# Altium schematic sheet HVin.SchDoc
size A; SheetNumber: 5; SheetTotal: 5
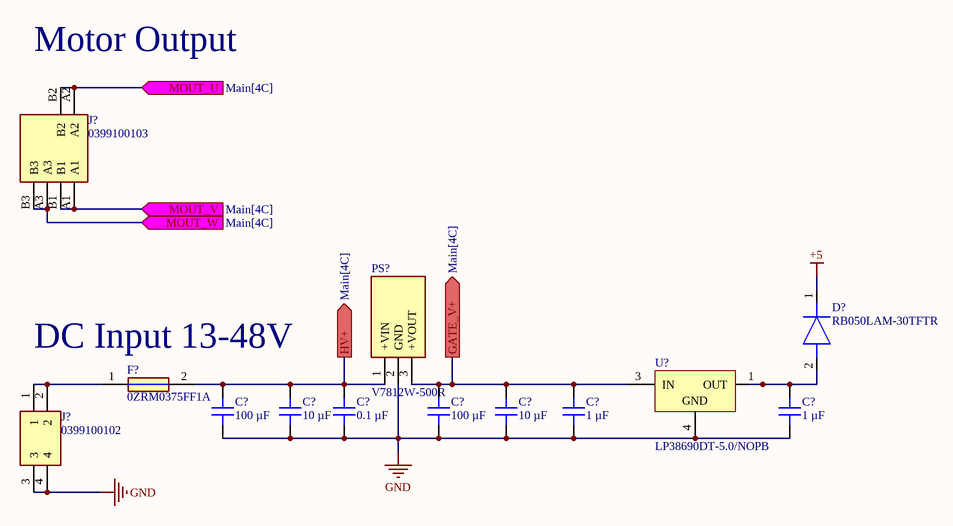
[diagram p0: HVin.SchDoc]

## Parts
(Parts that share a designator on the sheet are numbered #1, #2 ... from top to bottom, then left to right.)
C?#1  100 µF  [CAP 1206_3216 - 0.8MM]
C?#2  10 µF  [CAP 1206_3216 - 0.8MM]
C?#3  0.1 µF  [CAP 1206_3216 - 0.8MM]
C?#4  100 µF  [CAP 1206_3216 - 0.8MM]
C?#5  10 µF  [CAP 1206_3216 - 0.8MM]
C?#6  1 µF  [CAP 1206_3216 - 0.8MM]
C?#7  1 µF  [CAP 1206_3216 - 0.8MM]
D?  RB050LAM-30TFTR  [SODFL4725X95N]
F?  0ZRM0375FF1A  [0ZRM0375FF1A]
J?#1  0399100103  [0399100103]
J?#2  0399100102  [0399100102]
PS?  V7812W-500R  [V78121000R]
U?  LP38690DT-5.0/NOPB  [NDP0003B_M]

## Ports
GATE_V+ (out, see Main[4C]), HV+ (out, see Main[4C]), MOUT_U (in, see Main[4C]), MOUT_V (in, see Main[4C]), MOUT_W (in, see Main[4C])

## Nets
+5: D?.1(K)
GND: C?#1.1 C?#2.1 C?#3.1 C?#4.1 C?#5.1 C?#6.1 C?#7.1 J?#2.3 J?#2.4 PS?.2(GND) U?.4(GND)
GATE_V+: C?#4.2 C?#5.2 C?#6.2 PS?.3(+VOUT) U?.3(IN) ; port GATE_V+
HV+: C?#1.2 C?#2.2 C?#3.2 F?.2 PS?.1(+VIN) ; port HV+
MOUT_U: J?#1.A2 J?#1.B2 ; port MOUT_U
MOUT_V: J?#1.A1 J?#1.B1 ; port MOUT_V
MOUT_W: J?#1.A3 J?#1.B3 ; port MOUT_W
NetC?#7_2: C?#7.2 D?.2(A) U?.1(OUT)
NetF?_1: F?.1 J?#2.1 J?#2.2

## Notes on the sheet
- Motor Output
- DC Input 13-48V

## Library data of the parts
C?#1 C?#4 = C3216X5R0J107M160AB: CAP CER 100UF 6.3V X5R 1206; manufacturer: TDK Corporation; Tolerance: ±20%; Part Number: C3216X5R0J107M160AB; Value: 100 µF; Applications: General Purpose; Capacitance: 100 µF; componentlink1description: Datasheet; componentlink1url: https://product.tdk.com/info/en/catalog/datasheets/mlcc_commercial_general_en.pdf?ref_disty=digikey; componentlink2description: DigiKey Link; componentlink2url: https://www.digikey.com/en/products/detail/tdk-corporation/C3216X5R0J107M160AB/2443486; Device Package: 1206 (3216 Metric); Features: Low ESL; lastupdated: 2/6/2023 8:14:29 PM; Lifecycle Status: Active; Minimum Order: 1; Mounting Type: Surface Mount, MLCC; Operating Temperature: -55°C ~ 85°C; Package / Case: 1206 (3216 Metric); packaging: TapeAndReel; partid: 21199; Part Status: Active; price: 0.29; series: C; Size / Dimension: 0.126" L x 0.063" W (3.20mm x 1.60mm); Supplier 1: DigiKey; Supplier Part Number 1: 445-6008-1-ND; Temperature Coefficient: X5R; Thickness (Max): 0.075" (1.90mm); Voltage - Rated: 6.3V
C?#2 C?#5 = GRM31CR71E106KA12K: CAP CER 10UF 25V X7R 1206; manufacturer: Murata Electronics; Tolerance: ±10%; Part Number: GRM31CR71E106KA12K; Value: 10 µF; Applications: General Purpose; Capacitance: 10 µF; componentlink1description: Datasheet; componentlink1url: https://search.murata.co.jp/Ceramy/image/img/A01X/G101/ENG/GRM31CR71E106KA12-01.pdf; componentlink2description: DigiKey Link; componentlink2url: https://www.digikey.com/en/products/detail/murata-electronics/GRM31CR71E106KA12K/4905618; Device Package: 1206 (3216 Metric); lastupdated: 2/6/2023 8:14:40 PM; Lifecycle Status: Active; Minimum Order: 1; Mounting Type: Surface Mount, MLCC; Operating Temperature: -55°C ~ 125°C; Package / Case: 1206 (3216 Metric); packaging: TapeAndReel; partid: 19493; Part Status: Active; price: 0.06; series: GRM; Size / Dimension: 0.126" L x 0.063" W (3.20mm x 1.60mm); Supplier 1: DigiKey; Supplier Part Number 1: 490-14678-1-ND; Temperature Coefficient: X7R; Thickness (Max): 0.071" (1.80mm); Voltage - Rated: 25V
C?#3 = CC1206MRY5V9BB104: CAP CER 0.1UF 50V Y5V 1206; manufacturer: Yageo; Temperature Coefficient: Y5V (F); Tolerance: ±20%; Part Number: CC1206MRY5V9BB104; Value: 0.1 µF; Applications: General Purpose; Capacitance: 0.1 µF; componentlink1description: Datasheet; componentlink1url: http://www.yageo.com/documents/recent/UPY-GPHC_Y5V_6.3V-to-50V_8.pdf; componentlink2description: DigiKey Link; componentlink2url: https://www.digikey.com/en/products/detail/yageo/CC1206MRY5V9BB104/5884674; Device Package: 1206 (3216 Metric); lastupdated: 2/6/2023 8:14:35 PM; Lifecycle Status: Active; Minimum Order: 1; Mounting Type: Surface Mount, MLCC; Operating Temperature: -30°C ~ 85°C; Package / Case: 1206 (3216 Metric); packaging: TapeAndReel; partid: 18711; Part Status: Active; price: 0.05; series: CC; Size / Dimension: 0.126" L x 0.063" W (3.20mm x 1.60mm); Supplier 1: DigiKey; Supplier Part Number 1: 311-4504-1-ND; Thickness (Max): 0.028" (0.70mm); Voltage - Rated: 50V
C?#6 C?#7 = CC1206KKX7R8BB105: CAP CER 1UF 25V X7R 1206; manufacturer: Yageo; Tolerance: ±10%; Part Number: CC1206KKX7R8BB105; Value: 1 µF; Applications: General Purpose; Capacitance: 1 µF; componentlink1description: Datasheet; componentlink1url: https://www.yageo.com/upload/media/product/productsearch/datasheet/mlcc/UPY-GPHC_X7R_6.3V-to-50V_18.pdf; componentlink2description: DigiKey Link; componentlink2url: https://www.digikey.com/en/products/detail/yageo/CC1206KKX7R8BB105/2103094; Device Package: 1206 (3216 Metric); lastupdated: 2/6/2023 8:14:35 PM; Lifecycle Status: Active; Minimum Order: 1; Mounting Type: Surface Mount, MLCC; Operating Temperature: -55°C ~ 125°C; Package / Case: 1206 (3216 Metric); packaging: TapeAndReel; partid: 18923; Part Status: Active; price: 0.03; series: CC; Size / Dimension: 0.126" L x 0.063" W (3.20mm x 1.60mm); Supplier 1: DigiKey; Supplier Part Number 1: 311-1356-1-ND; Temperature Coefficient: X7R; Thickness (Max): 0.045" (1.15mm); Voltage - Rated: 25V
D? = RB050LAM-30TFTR: Diode; Manufacturer_Name: ROHM Semiconductor; Datasheet Link: https://componentsearchengine.com/Datasheets/1/RB050LAM-30TFTR.pdf; Height: 0.95mm; Manufacturer_Part_Number: RB050LAM-30TFTR; Mouser Part Number: 755-RB050LAM-30TFTR; Mouser Price/Stock: https://www.mouser.co.uk/ProductDetail/ROHM-Semiconductor/RB050LAM-30TFTR?qs=HXFqYaX1Q2xO84kRCTSWAQ%3D%3D
F? = 0ZRM0375FF1A: Fuse; Manufacturer_Name: BelFuse; Datasheet Link: https://www.mouser.com/datasheet/2/643/ds-CP-0zrm-series-1664109.pdf; Height: 34mm; Manufacturer_Part_Number: 0ZRM0375FF1A; Mouser Part Number: 530-0ZRM0375FF1A; Mouser Price/Stock: https://www.mouser.co.uk/ProductDetail/Bel-Fuse/0ZRM0375FF1A?qs=MvPYbBWWJyvr16E%252BkpbJXQ%3D%3D
J?#1 = 0399100103: Connector; Manufacturer_Name: Molex; Datasheet Link: https://www.molex.com/pdm_docs/sd/399100103_sd.pdf; Height: 30mm; Manufacturer_Part_Number: 0399100103; Mouser Part Number: N/A; Mouser Price/Stock: https://www.mouser.co.uk/ProductDetail/Molex/0399100103?qs=%252BdQmOuGyFcE%2Fyr5UJhNqQA%3D%3D; Arrow Part Number: 0399100103; Arrow Price/Stock: https://www.arrow.com/en/products/0399100103/molex?region=nac
J?#2 = 0399100102: Connector; Manufacturer_Name: Molex; Datasheet Link: https://www.molex.com/pdm_docs/sd/399100102_sd.pdf; Height: 29.7mm; Manufacturer_Part_Number: 0399100102; Mouser Part Number: N/A; Mouser Price/Stock: https://www.mouser.co.uk/ProductDetail/Molex/0399100102?qs=PBcRNPEHKso3EAnX8hJm1w%3D%3D; Arrow Part Number: 0399100102; Arrow Price/Stock: https://www.arrow.com/en/products/0399100102/molex
PS? = V7812W-500R: Power Supply; Manufacturer_Name: CUI Inc.; Datasheet Link: https://www.cui.com/product/resource/v78xx-1000.pdf; Height: 9mm; Manufacturer_Part_Number: V7812W-500R; Mouser Part Number: 490-V7812W-500R; Mouser Price/Stock: https://www.mouser.co.uk/ProductDetail/CUI-Inc/V7812W-500R?qs=WyjlAZoYn5223%2F9I6AQjMw%3D%3D; Arrow Part Number: V7812W-500R; Arrow Price/Stock: https://www.arrow.com/en/products/v7812w-500r/cui-inc
U? = CMP-0062-00280-3: 1A Low Dropout CMOS Linear Regulators Stable with Ceramic Output Capacitors, 3-pin TO-252, Pb-Free; Manufacturer: Texas Instruments; PackageTopMarking: NSUZXYTT*LP38690*DT-5.0; CompType: LDO IC; PowerWise: Y; ComponentLink1URL: http://www.ti.com/general/docs/lit/getliterature.tsp?genericPartNumber=LP38690&fileType=pdf; RoHS: Y; ComponentLink1Description: Datasheet URL; PackageDescription: TO252, Molded, Jedec, 6.8 x 6.10 x 2.30mm Body, 3 Lead, 2.28mm Pitch, Surface Mount; Code_JEDEC: TO-252-AA; PinCount: 3; PackageReference: NDP0003B